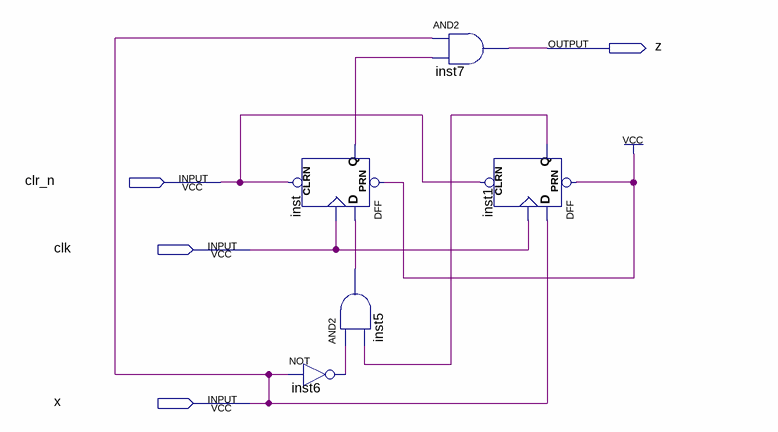
[diagram p0: schematic sheet]
// Quartus schematic ch14_1.bdf as structural Verilog: 5 symbols, 4 pins
module ch14_1 (
  input  clr_n,
  input  clk,
  input  x,
  output z
);

  wire inst1_q, inst5_out, inst6_out, inst_q;

  DFF inst (.CLRN(clr_n), .CLK(clk), .D(inst5_out), .PRN(1'b1), .Q(inst_q));
  and inst5 (inst5_out, inst6_out, inst1_q);
  not inst6 (inst6_out, x);
  and inst7 (z, x, inst_q);
  DFF inst1 (.CLRN(clr_n), .CLK(clk), .D(x), .PRN(1'b1), .Q(inst1_q));
endmodule
